# EAGLE design led2ch_v0.1 (EAGLE 7.7.0)
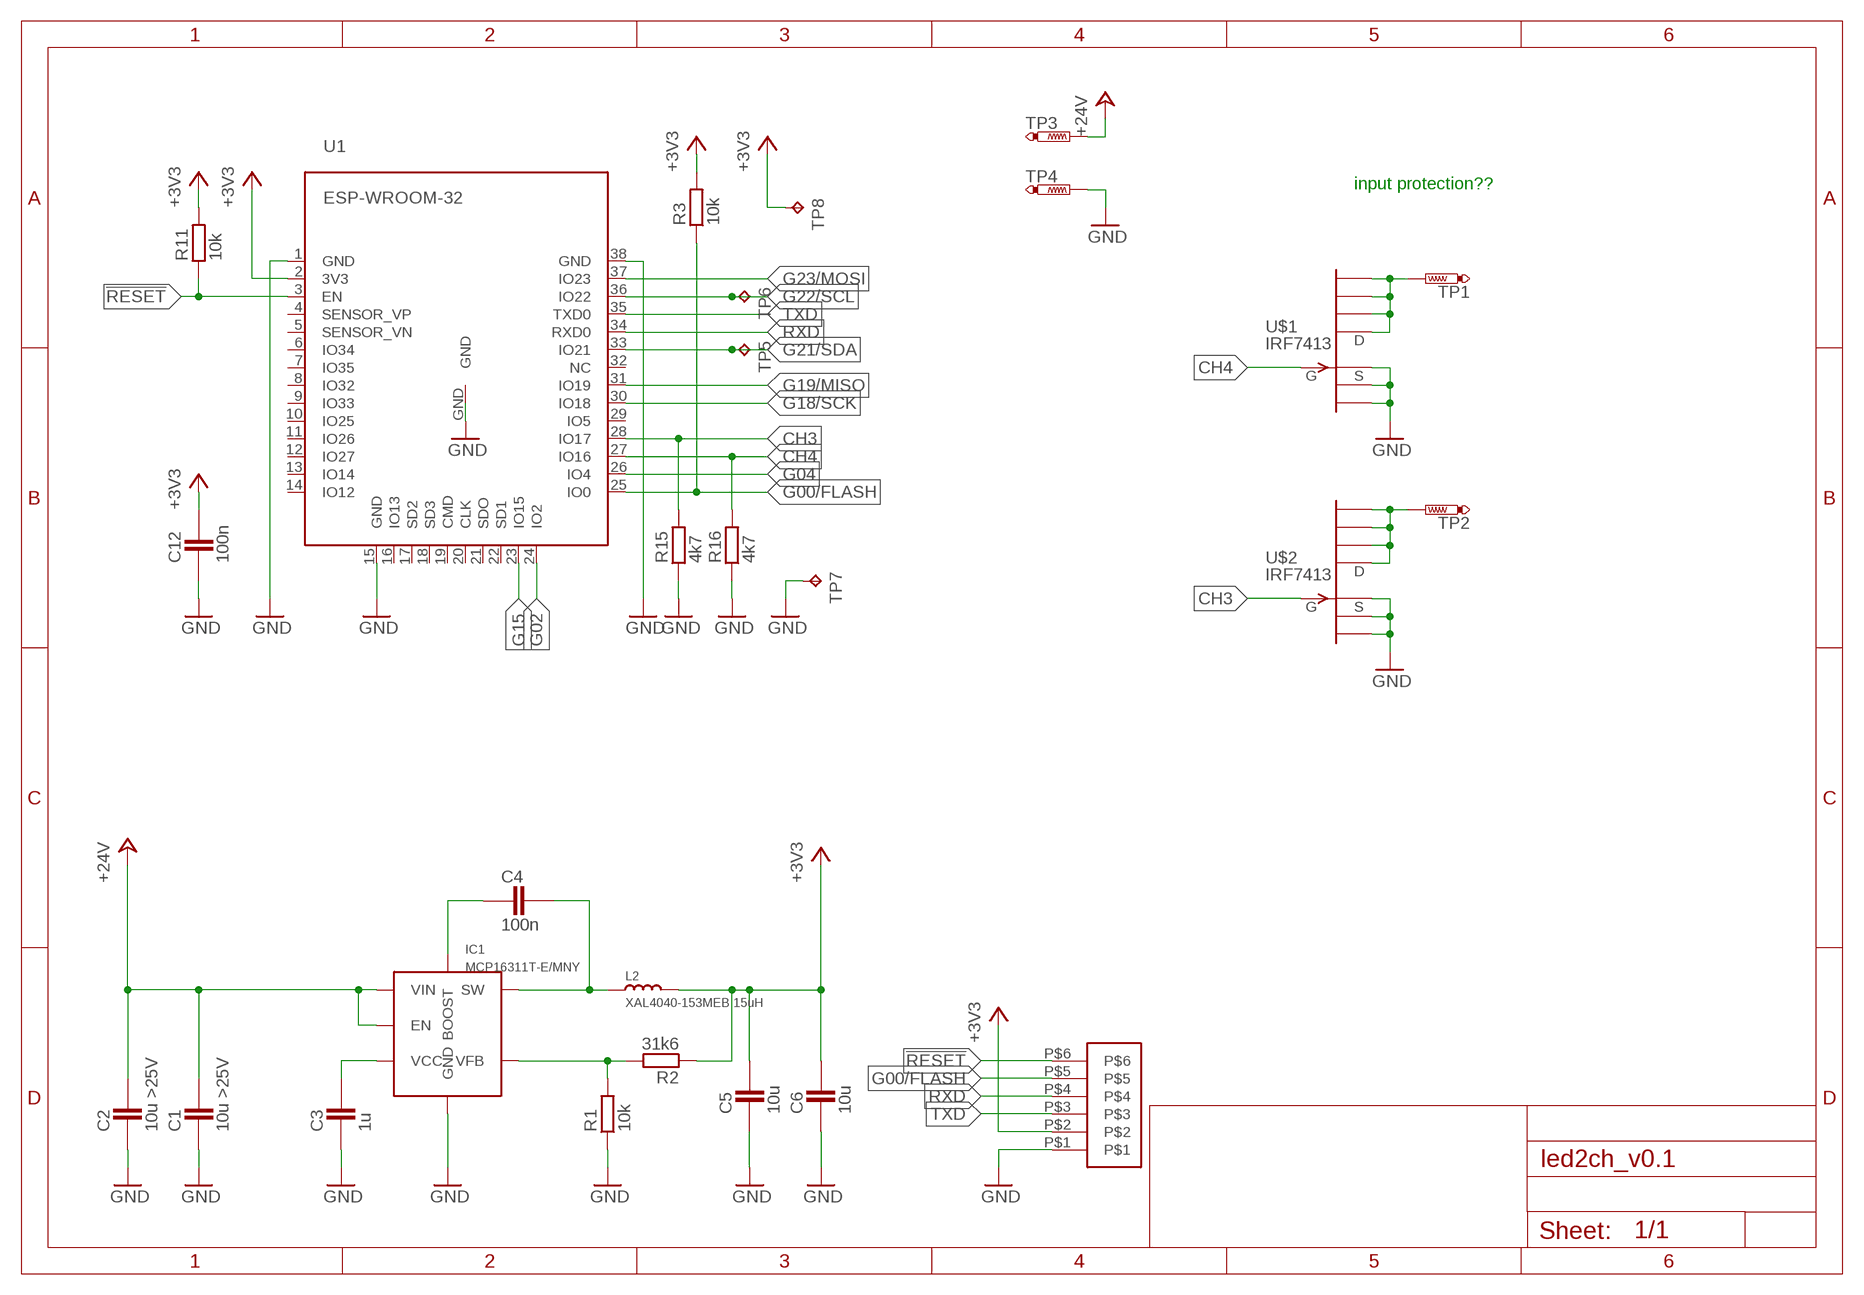
[diagram p0: schematic, sheet 1]

## Parts
C1  10u >25V  CAPACITOR_0805  [CAPC2012X145AN]
C2  10u >25V  CAPACITOR_0805  [CAPC2012X145AN]
C3  1u  CAPACITOR_0603  [CAPC1608X92N]
C4  100n  CAPACITOR_0402  [CAPC1005X60N]
C5  10u  CAPACITOR_0805  [CAPC2012X145AN]
C6  10u  CAPACITOR_0805  [CAPC2012X145AN]
C12  100n  CAPACITOR_0402  [CAPC1005X60N]
IC1  MCP16311T-E/MNY  MCP16311-TDFN  [TDFN8]
L2  XAL4040-153MEB 15uH  SMD-POWER-INDUCTOR-4.7UH-20%-750MA(2P-3.9X3.9MM)  [L0420]
R1  10k  RESISTOR_0402  [RESC1005X40AN]
R2  31k6  RESISTOR_0402  [RESC1005X40AN]
R3  10k  RESISTOR_0402  [RESC1005X40AN]
R11  10k  RESISTOR_0402  [RESC1005X40AN]
R15  4k7  RESISTOR_0402  [RESC1005X40AN]
R16  4k7  RESISTOR_0402  [RESC1005X40AN]
TP1  PTR1B1,27  [B1,27]
TP2  PTR1B1,27  [B1,27]
TP3  PTR1B2,54  [B2,54]
TP4  PTR1B2,54  [B2,54]
TP5  TPB1,27  [B1,27]
TP6  TPB1,27  [B1,27]
TP7  TPB1,27  [B1,27]
TP8  TPB1,27  [B1,27]
U1  ESP-WROOM-32  [ESP-WROOM-32]
U$1  IRF7413  [SO-8]
U$2  IRF7413  [SO-8]
U$3  3X2-2.00RM  [3X2-2.00RM]

## Nets
!RESET: R11.1 U1.3(EN) U$3.P$6
+3V3: C5.2 C6.2 C12.2 L2.2 R2.1 R3.2 R11.2 TP8.TP U1.2(3V3) U$3.P$2
+24V: C1.2 C2.2 IC1.P$3(EN) IC1.P$4(VIN) TP3.TP
CH3: R15.2 U1.28(IO17) U$2.4(G)
CH4: R16.2 U1.27(IO16) U$1.4(G)
G00/FLASH: R3.1 U1.25(IO0) U$3.P$5
G02: U1.24(IO2)
G04: U1.26(IO4)
G15: U1.23(IO15)
G18/SCK: U1.30(IO18)
G19/MISO: U1.31(IO19)
G21/SDA: TP5.TP U1.33(IO21)
G22/SCL: TP6.TP U1.36(IO22)
G23/MOSI: U1.37(IO23)
GND: C1.1 C2.1 C3.1 C5.1 C6.1 C12.1 IC1.P$5(GND) IC1.P$8(GND) IC1.P$9(GND) R1.1 R15.1 R16.1 TP4.TP TP7.TP U1.1(GND) U1.15(GND) U1.38(GND) U1.GND U$1.1(S) U$1.2(S1) U$1.3(S2) U$2.1(S) U$2.2(S1) U$2.3(S2) U$3.P$1
N$1: C3.2 IC1.P$2(VCC)
N$3: C4.1 IC1.P$7(BOOST)
N$4: C4.2 IC1.P$6(SW) L2.1
N$5: IC1.P$1(VFB) R1.2 R2.2
N$7: TP1.TP U$1.5(D) U$1.6(D1) U$1.7(D2) U$1.8(D3)
N$8: TP2.TP U$2.5(D) U$2.6(D1) U$2.7(D2) U$2.8(D3)
RXD: U1.34(RXD0) U$3.P$4
TXD: U1.35(TXD0) U$3.P$3
Unconnected: U1.4(SENSOR_VP) U1.5(SENSOR_VN) U1.6(IO34) U1.7(IO35) U1.8(IO32) U1.9(IO33) U1.10(IO25) U1.11(IO26) U1.12(IO27) U1.13(IO14) U1.14(IO12) U1.16(IO13) U1.17(SD2) U1.18(SD3) U1.19(CMD) U1.20(CLK) U1.21(SDO) U1.22(SD1) U1.29(IO5) U1.32(NC)

## Notes on the sheet
- input protection??

## Library data of the parts
C1-C6 C12 = ipc-7351-capacitor:CAPACITOR_
IC1 = sid:MCP16311-TDFN
L2 = Seeed-OPL-Inductor:SMD-POWER-INDUCTOR-4.7UH-20%-750MA(2P-3.9X3.9MM): 303010015; MPN: SPD3D16-4R7M; VALUE: 4.7UH
R1-R3 R11 R15 R16 = ipc-7351-resistor:RESISTOR_
TP1-TP4 = testpad:PTR1: TEST PIN
TP5-TP8 = testpad:TP: Test pad
U1 = esp32:ESP-WROOM-32
U$1 U$2 = transistor-fet:IRF7413
U$3 = falkor:3X2-2.00RM

## Board
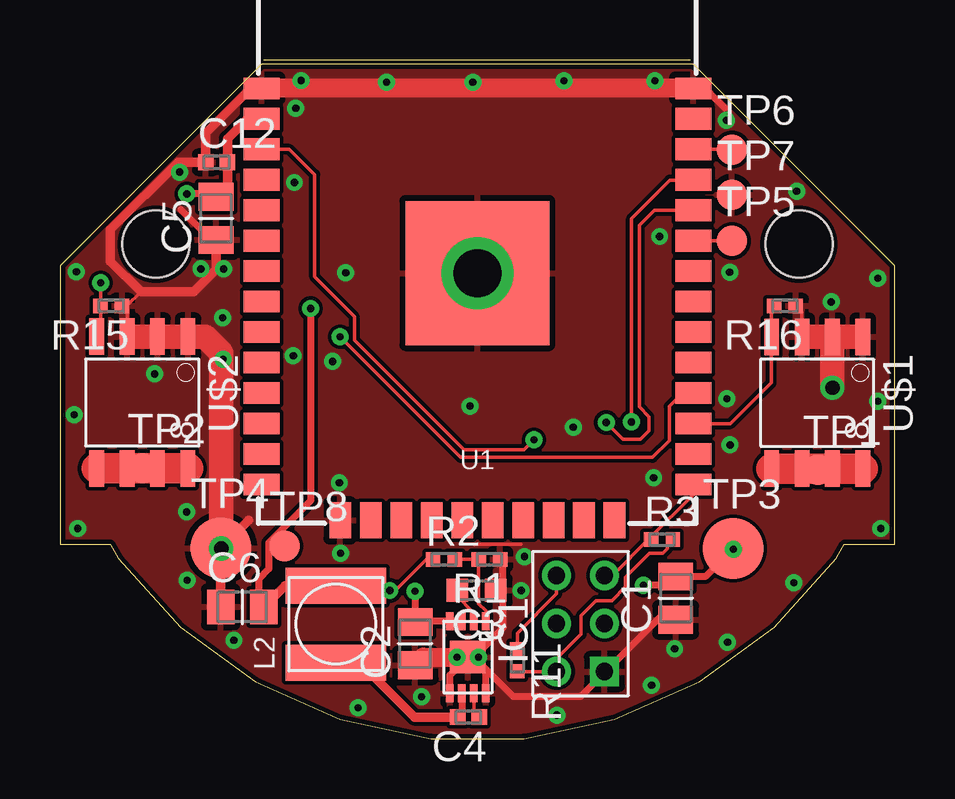
[diagram p1: board, top side]
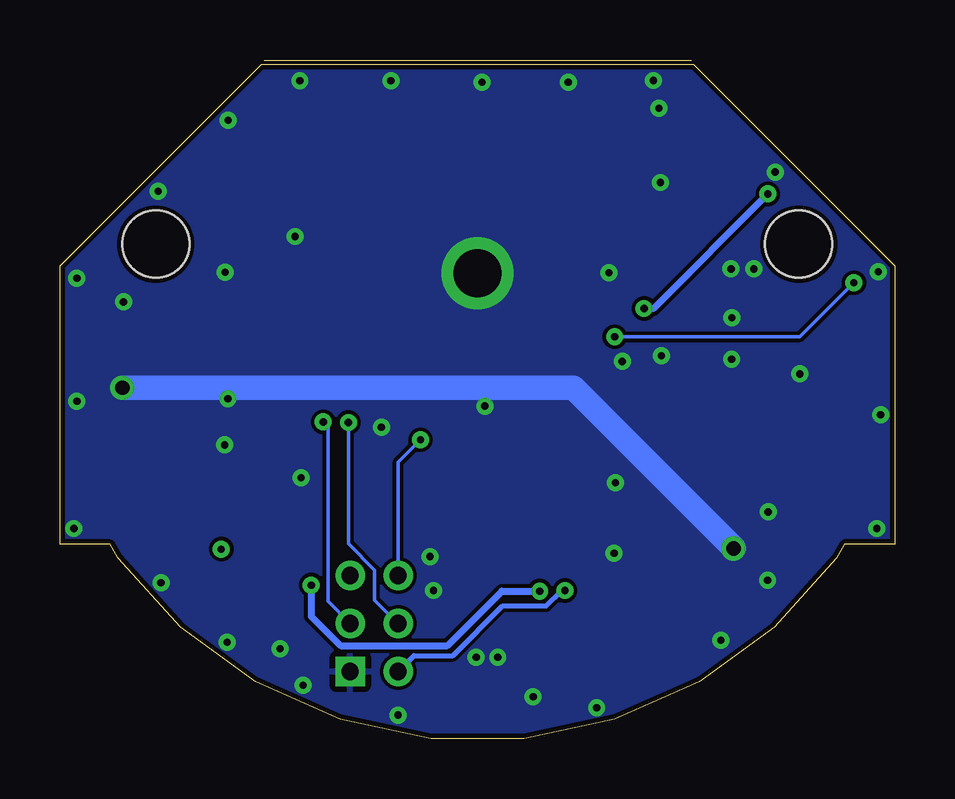
[diagram p2: board, bottom side, seen from below]

Size 34.8 x 28.28 mm. Coordinates in mm from the lower left corner, seen from the top.
Outline: 26.28,28.28 8.48,28.28
Outline: 23.12,0.8 26.65,2.38 29.78,4.65 32.37,7.52 32.7,8.1 34.8,8.1 34.8,19.7 26.4,28.1 8.4,28.1 0,19.7 0,8.1 2.1,8.1 2.43,7.52 5.02,4.65 8.15,2.38 11.68,0.8 15.47,0 19.33,0 23.12,0.8
Copper layers (1*16): Top 0.035mm / dielectric 1.5mm / Bottom 0.035mm
Design rules "default *": minimum track width 0.15mm, minimum drill 0.3mm, track to track 6mil, track to pad 6mil, pad to pad 6mil, via to via 6mil, smd to smd 6mil, copper to edge 8mil, drill to drill 8mil, minimum pad ring 10mil, minimum via ring 8mil, stop-mask expansion 4mil, vias tented up to drill 0.7mm, thermal gap 10mil
Holes 2.8 mm at 4,20.6 30.8,20.6

### Footprints (pad centres in the part's own frame; a part is rotated, then mirrored left to right if it is on the bottom)
CAPC2012X145AN = smd 1.15 x 1.45: 1 -0.9,0; 2 0.9,0
CAPC1608X92N = smd 0.9 x 0.95: 1 -0.8,0; 2 0.8,0
CAPC1005X60N = smd 0.65 x 0.65: 1 -0.45,0; 2 0.45,0
TDFN8 = smd 0.75 x 0.3: P$1 -1.5,0.75; P$2 -1.5,0.25; P$3 -1.5,-0.25; P$4 -1.5,-0.75; P$5 1.5,-0.75; P$6 1.5,-0.25; P$7 1.5,0.25; P$8 1.5,0.75 | smd 1.36 x 1.46: P$9 0,0
L0420 = smd 1.5 x 4.2: 1 -1.6,0; 2 1.6,0
RESC1005X40AN = smd 0.6 x 0.6: 1 -0.45,0; 2 0.45,0
B1,27 = smd 1.27 x 1.27: TP 0,0
B2,54 = smd 2.54 x 2.54: TP 0,0
ESP-WROOM-32 = smd 0.9 x 1.5: 1 7.7,9; 2 6.43,9; 3 5.16,9; 4 3.89,9; 5 2.62,9; 6 1.35,9; 7 0.08,9; 8 -1.19,9; 9 -2.46,9; 10 -3.73,9; 11 -5,9; 12 -6.27,9; 13 -7.54,9; 14 -8.81,9; 25 -8.81,-9; 26 -7.54,-9; 27 -6.27,-9; 28 -5,-9; 29 -3.73,-9; 30 -2.46,-9; 31 -1.19,-9; 32 0.08,-9; 33 1.35,-9; 34 2.62,-9; 35 3.89,-9; 36 5.16,-9; 37 6.43,-9; 38 7.7,-9 | smd 1.5 x 0.9: 15 -10.3,5.715; 16 -10.3,4.445; 17 -10.3,3.175; 18 -10.3,1.905; 19 -10.3,0.635; 20 -10.3,-0.635; 21 -10.3,-1.905; 22 -10.3,-3.175; 23 -10.3,-4.445; 24 -10.3,-5.715 | smd 6 x 6: GND 0,0
SO-8 = smd 1.524 x 0.61: 1 -2.743,1.27; 2 -2.743,0; 3 -2.743,-1.27; 4 -2.743,-2.54; 5 2.743,-2.54; 6 2.743,-1.27; 7 2.743,0; 8 2.743,1.27
3X2-2.00RM = drill 0.711 square: P$1 -2,0 | drill 0.711: P$2 -2,2; P$3 0,0; P$4 0,2; P$5 2,0; P$6 2,2

### Placement (x,y rotation side)
C1  25.67,5.85 90 top
C2  14.81,3.96 90 top
C3  17.37,6.18 180 top
C4  17.02,0.9 180 top
C5  6.51,21.68 90 top
C6  7.6,5.49 0 top
C12  6.53,24.02 0 top
IC1  17,3.4 270 top
L2  11.5,4.77 90 top
R1  17.9,7.47 180 top
R2  16,7.47 0 top
R3  25.1,8.3 0 top
R11  19.07,3.26 270 top
R15  2.14,18.03 180 top
R16  30.22,18.03 180 top
TP1  31.6,11.2 0 top
TP2  3.44,11.27 0 top
TP3  28.07,7.92 0 top
TP4  6.71,7.94 0 top
TP5  28.02,20.74 0 top
TP6  28.02,24.55 0 top
TP7  28.02,22.66 0 top
TP8  9.36,8.03 0 top
U1  17.4,19.4 90 top
U$1  32.2,14 270 top
U$2  4.07,14.01 270 top
U$3  22.7,4.8 90 top

### Tracks (layer width: path | path; a pad name or v marks a point on that pad's centre or on a via)
!RESET  (via drill 0.3)
  Top 0.15: R11.1 19.07,4.4 20.7,6.03 U$3.P$6 | v19.77,12.46 19.34,12.04 16.84,12.04 12.28,16.6 12.28,17.57 10.62,19.24 10.62,23.5 9.55,24.56 U1.3
  Bottom 0.15: U$3.P$6 20.7,11.52 v19.77,12.46
+3V3  (via drill 0.3)
  Top 0.15: R2.1 15.27,7.47 13.97,6.17 v13.75,6.17 11.53,6.17 L2.2 | R11.2 19.18,2.8 U$3.P$2 20.7,3.32 21.73,4.35 21.73,5.12 22.35,5.75 23,5.75 23.57,6.32 23.57,6.72 24.57,7.72 25.12,7.72 25.32,7.92 25.32,8.07 R3.2 | TP8.TP 8.7,8.03
  Top 0.3: C5.2 6.51,22.7 v5.29,22.7 | v10.45,17.92 10.45,9.92 8.7,8.17 8.7,8.03 8.7,7.07 8.28,6.65 8.28,5.71 C6.2
  Top 0.4: L2.2 9.38,6.37 C6.2 | U1.2 8.37,25.8 7.78,25.8 6.98,25 C12.2 6.98,23.05 C5.2
  Bottom 0.2: U$3.P$2 20.04,3.46 18.41,3.46 16.34,5.53 14.53,5.53 13.88,6.17 v13.75,6.17
  Bottom 0.3: v5.29,22.7 10.06,17.92 v10.45,17.92
+24V  (via drill 0.3)
  Top 0.15: v28.07,7.9 TP3.TP
  Top 0.3: TP3.TP 26.91,6.75 C1.2 25.14,6.4 v24.32,6.4 | v14.8,6.15 C2.2 14.85,4.9 IC1.P$4 IC1.P$3
  Bottom 0.3: v24.32,6.4 24.32,5.1 23.1,3.87 18.65,3.87 16.38,6.15 v14.8,6.15
CH3  (via drill 0.3)
  Top 0.15: U1.28 25.95,14.4 25.4,13.85 25.4,12.42 24.7,11.72 16.7,11.72 v11.68,16.75 | v1.7,19 R15.2 1.69,16.91 U$2.4
  Bottom 0.15: v11.68,16.75 3.95,16.75 v1.7,19
CH4
  Top 0.15: U1.27 27.95,13.13 29.65,14.82 U$1.4 29.66,17.92 R16.2
G00/FLASH
  Top 0.15: U$3.P$5 23.02,6.8 24.57,8.35 | 24.57,8.35 26.4,10.17 U1.25 | R3.1 24.6,8.35 24.57,8.35
G21/SDA
  Top 0.15: U1.33 TP5.TP
G22/SCL
  Top 0.15: U1.36 TP6.TP
GND  (via drill 0.3, 0.6, 2)
  Top 0.15: R16.1 30.93,17.77 U$1.3 31.15,16.75 | 33.25,16.75 U$1.1 | 3.03,16.75 U$2.3 2.8,17.82 R15.1 2.78,18.03 3.38,18.62 | U$2.1 5.52,16.75 5.53,16.75 | 17.29,8.08 17.32,8.11 19.23,8.11
  Top 0.3: C1.1 25.17,5.22 21.7,1.75 18.9,1.75 17.81,2.84 | 17.81,2.84 17.25,3.4 | 17.25,3.4 IC1.P$9 16.25,2.65 IC1.P$5 | 17.25,3.4 18.48,4.62 18.48,6.2 | 18.48,6.2 18.48,7.5 R1.1 | C3.1 18.17,6.2 18.48,6.2 | IC1.P$8 17.75,2.77 17.81,2.84 | 26.3,27.07 26.92,27.07 27.7,26.29 | 6.53,20.75 6.35,20.75 5.05,22.05
  Top 0.4: C6.1 6.7,7.93 TP4.TP 7.87,9.1 | U1.1 7.95,27.1 6.08,25.23 C12.1 4.92,24.02 2.1,21.2 2.1,19.9 3.38,18.62 5.58,18.62 6.51,19.56 C5.1
  Top 0.8: C2.1 15.15,3.4 IC1.P$9 | U1.38 U1.1
  Top 1.016: TP4.TP 6.71,16.08 6.05,16.75 5.53,16.75 U$2.2 3.03,16.75 3.33,16.75 | U$1.2 v32.2,14.62 | U$1.2 31.15,16.75 | U$1.2 33.25,16.75
  Bottom 1.016: v32.2,14.62 13.39,14.62 TP4.TP
  other vias: 17.4,19.4 19.23,6.17 6.72,7.92 15.07,1.75 7.25,4.1 25.62,3.75 5.88,19.57 6.82,19.57 11.7,7.72 25,20.92 5.28,9.45 5.3,6.6 32.15,18.2 21.4,12.97 24.75,10.87 3.95,15.2 0.75,8.76 0.59,13.5 0.69,19.46 4.99,23.61 10.05,27.42 13.61,27.35 17.21,27.35 21,27.41 24.8,27.41 27.79,25.77 30.71,22.81 34.09,19.18 34.09,14.05 34.22,8.76 30.59,6.49 27.83,4.02 24.66,2.23 20.71,0.98 12.43,1.29 19.37,7.59 11.64,10.66 17.09,13.86 27.93,12.24 27.8,14.16 27.92,19.44 6.79,17.53 6.8,15.81 9.77,23.17 11.91,19.41 11.36,15.72 9.72,15.96 9.83,26.26 17.45,3.4 16.55,3.4
  pour Top: -0.2,28.3 -0.2,-0.2 35,-0.2 35,28.3
  pour Bottom: -0.2,28.2 -0.2,-0.1 35,-0.1 35,28.2
N$1
  Top 0.15: IC1.P$2 17.2,4.95 17.2,5.3 16.57,5.93 C3.2
N$3
  Top 0.15: IC1.P$7 17.25,0.9 C4.1
N$4
  Top 0.3: IC1.P$6 16.75,1.07 C4.2
  Top 0.4: L2.1 12.68,3 14.77,0.9 C4.2
N$5
  Top 0.15: IC1.P$1 17.75,5.32 17.45,5.62 R1.2 R2.2
N$7
  Top 1.27: U$1.5 U$1.6 31.66,11.26 | U$1.8 U$1.7 31.67,11.26 31.66,11.26 | TP1.TP 31.66,11.26
N$8
  Top 1.27: U$2.8 U$2.7 TP2.TP | TP2.TP U$2.6 U$2.5 | TP2.TP
RXD  (via drill 0.3)
  Top 0.15: v22.77,13.17 23.48,12.47 24.2,12.47 24.55,12.82 24.55,13.42 24.15,13.82 24.15,21.4 24.77,22.02 U1.34
  Bottom 0.15: U$3.P$4 21.68,5.77 21.68,7.02 22.77,8.12 v22.77,13.17
TXD  (via drill 0.3)
  Top 0.15: v23.82,13.2 23.82,21.67 25.43,23.27 26.39,23.27 U1.35
  Bottom 0.15: U$3.P$3 23.62,5.72 23.62,13 v23.82,13.2